# EAGLE design turbiditySensor (EAGLE 8.7.1)
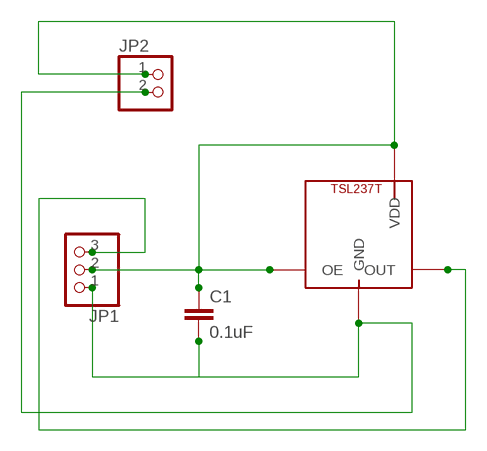
[diagram p0: schematic, sheet 1]

## Parts
C1  0.1uF  0.1UF-0603-25V-5%  [0603]
JP1  PINHD-1X3  [1X03]
JP2  PINHD-1X2  [1X02]
SENSOR  WS2812B3535  [LED3535]

## Nets
N$1: JP1.3 SENSOR.4(OUT)
N$4: C1.1 JP1.2 JP2.1 SENSOR.1(OE) SENSOR.3(VDD)
N$5: C1.2 JP1.1 JP2.2 SENSOR.2(GND)

## Library data of the parts
C1 = SparkFun-Capacitors:0.1UF: 0.1µF ceramic capacitors A capacitor is a passive two-terminal electrical component used to store electrical energy temporarily in an electric field.; PROD_ID: CAP-08604
JP1 = pinhead:PINHD-1X3: PIN HEADER
JP2 = pinhead:PINHD-1X2: PIN HEADER
SENSOR = Yaseen Alkhafaji:WS2812B

## Board
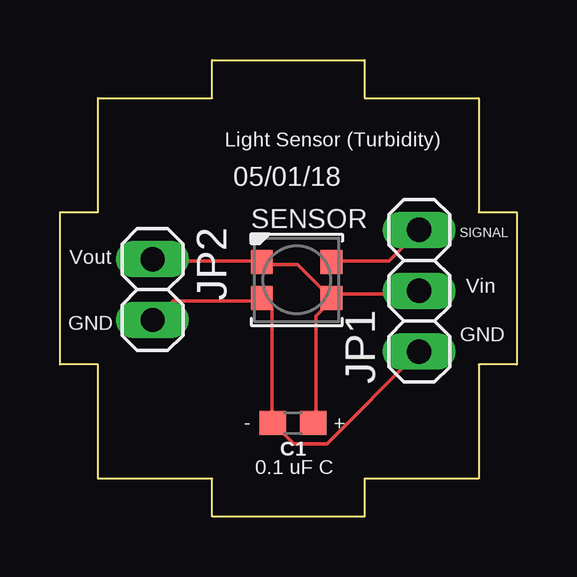
[diagram p1: board, top side]

Size 19.05 x 19.05 mm. Coordinates in mm from the lower left corner, seen from the top.
Outline: 1.59,1.59 1.59,6.35 0,6.35 0,12.7 1.59,12.7 1.59,17.46 6.35,17.46 6.35,19.05 12.7,19.05 12.7,17.46 17.46,17.46 17.46,12.7 19.05,12.7 19.05,6.35 17.46,6.35 17.46,1.59 12.7,1.59 12.7,0 6.35,0 6.35,1.59 1.59,1.59
Copper layers (1*16): Top 0.035mm / dielectric 1.5mm / Bottom 0.035mm
Design rules: minimum track width 6mil, minimum drill 0.35mm, track to track 6mil, track to pad 6mil, pad to pad 6mil, via to via 6mil, smd to smd 6mil, copper to edge 40mil, drill to drill 6mil, minimum pad ring 10mil, minimum via ring 8mil, stop-mask expansion 4mil, vias tented up to drill 0mil, thermal gap 10mil

### Footprints (pad centres in the part's own frame; a part is rotated, then mirrored left to right if it is on the bottom)
0603 = smd 1.1 x 1: 1 -0.85,0; 2 0.85,0
1X03 = drill 1.016 long: 1 -2.54,0; 2 0,0; 3 2.54,0
1X02 = drill 1.016 long: 1 -1.27,0; 2 1.27,0
LED3535 = smd 0.9 x 1: 1 -1.45,0.75; 2 -1.45,-0.75; 3 1.45,-0.75; 4 1.45,0.75

### Placement (x,y rotation side)
C1  9.72,3.91 180 top
JP1  14.98,9.43 90 top
JP2  3.86,9.47 270 top
SENSOR  9.87,9.88 0 top

### Tracks (layer width: path | path; a pad name or v marks a point on that pad's centre or on a via)
N$1
  Top 0.152: SENSOR.4 11.43,10.67 13.72,10.67 14.94,11.89 JP1.3
N$4
  Top 0.152: SENSOR.3 11.28,9.14 9.91,10.52 8.53,10.52 SENSOR.1 8.38,10.67 3.96,10.67 JP2.1 | C1.1 10.67,3.96 10.67,8.38 11.28,8.99 SENSOR.3 | JP1.2 14.94,9.3 11.58,9.3 11.43,9.14 SENSOR.3
N$5
  Top 0.152: JP2.2 3.96,8.23 4.72,8.99 8.38,8.99 SENSOR.2 8.53,8.99 8.84,8.69 8.84,3.96 C1.2 8.99,3.81 9.75,3.05 11.12,3.05 14.94,6.86 JP1.1

### Text on the board
tPlace: Light Sensor (Turbidity) | 05/01/18 | SIGNAL | Vout | Vin | GND | GND | - | + | 0.1 uF C